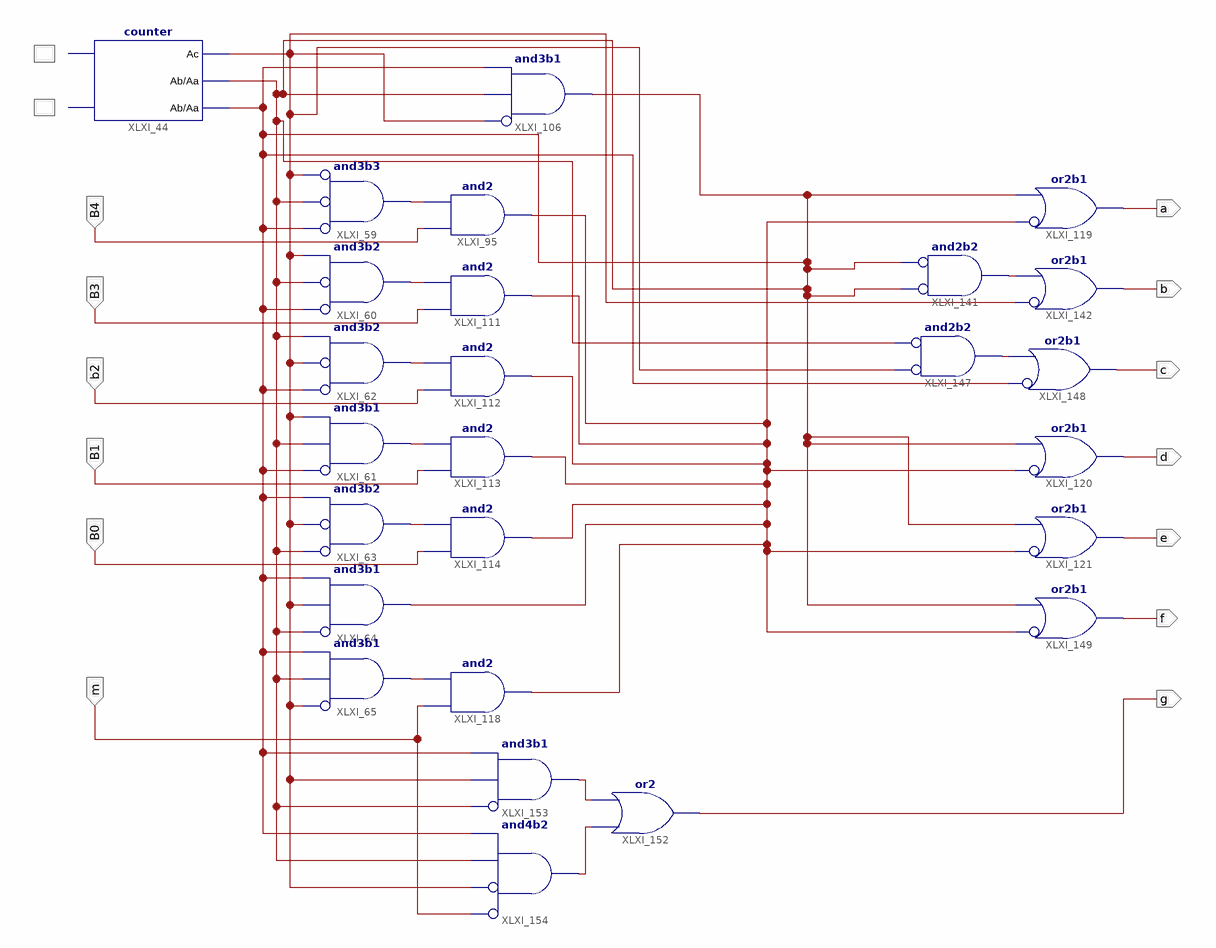
[diagram p0: schematic sheet 1]
// Xilinx ISE schematic Decoder.sch (xc9500xl) as structural Verilog: 26 symbols, 13 ports
module Decoder (
  input  B4,
  input  B3,
  input  b2,
  input  B1,
  input  B0,
  input  m,
  output a,
  output b,
  output c,
  output d,
  output e,
  output f,
  output g
);

  wire XLXN_69, XLXN_71, XLXN_116, XLXN_117, XLXN_133, XLXN_134, XLXN_135, XLXN_147, XLXN_242, XLXN_267,
       XLXN_283, XLXN_291, XLXN_292;

  counter XLXI_44 (.Ac(XLXN_69), .Ab(XLXN_71), .Aa(XLXN_71));  // open: Clk, Res
  and XLXI_59 (XLXN_116, ~XLXN_71, ~XLXN_71, ~XLXN_69);  // and3b3
  and XLXI_60 (XLXN_117, ~XLXN_71, ~XLXN_71, XLXN_69);  // and3b2
  and XLXI_62 (XLXN_133, ~XLXN_71, ~XLXN_69, XLXN_71);  // and3b2
  and XLXI_61 (XLXN_134, ~XLXN_71, XLXN_71, XLXN_69);  // and3b1
  and XLXI_63 (XLXN_135, ~XLXN_71, ~XLXN_69, XLXN_71);  // and3b2
  and XLXI_64 (XLXN_242, ~XLXN_71, XLXN_69, XLXN_71);  // and3b1
  and XLXI_65 (XLXN_147, ~XLXN_69, XLXN_71, XLXN_71);  // and3b1
  and XLXI_95 (XLXN_242, B4, XLXN_116);
  and XLXI_111 (XLXN_242, B3, XLXN_117);
  and XLXI_112 (XLXN_242, b2, XLXN_133);
  and XLXI_113 (XLXN_242, B1, XLXN_134);
  and XLXI_114 (XLXN_242, B0, XLXN_135);
  and XLXI_118 (XLXN_242, m, XLXN_147);
  and XLXI_106 (XLXN_71, ~XLXN_69, XLXN_71, XLXN_71);  // and3b1
  and XLXI_141 (XLXN_267, ~XLXN_71, ~XLXN_71);  // and2b2
  or XLXI_119 (a, ~XLXN_242, XLXN_71);  // or2b1
  or XLXI_120 (d, ~XLXN_242, XLXN_71);  // or2b1
  or XLXI_121 (e, ~XLXN_242, XLXN_71);  // or2b1
  or XLXI_142 (b, ~XLXN_69, XLXN_267);  // or2b1
  and XLXI_147 (XLXN_283, ~XLXN_69, ~XLXN_71);  // and2b2
  or XLXI_148 (c, ~XLXN_71, XLXN_283);  // or2b1
  or XLXI_149 (f, ~XLXN_242, XLXN_71);  // or2b1
  or XLXI_152 (g, XLXN_292, XLXN_291);
  and XLXI_153 (XLXN_291, ~XLXN_71, XLXN_69, XLXN_71);  // and3b1
  and XLXI_154 (XLXN_292, ~m, ~XLXN_69, XLXN_71, XLXN_71);  // and4b2
endmodule
